# EAGLE design IO60P16 (EAGLE 6.2)
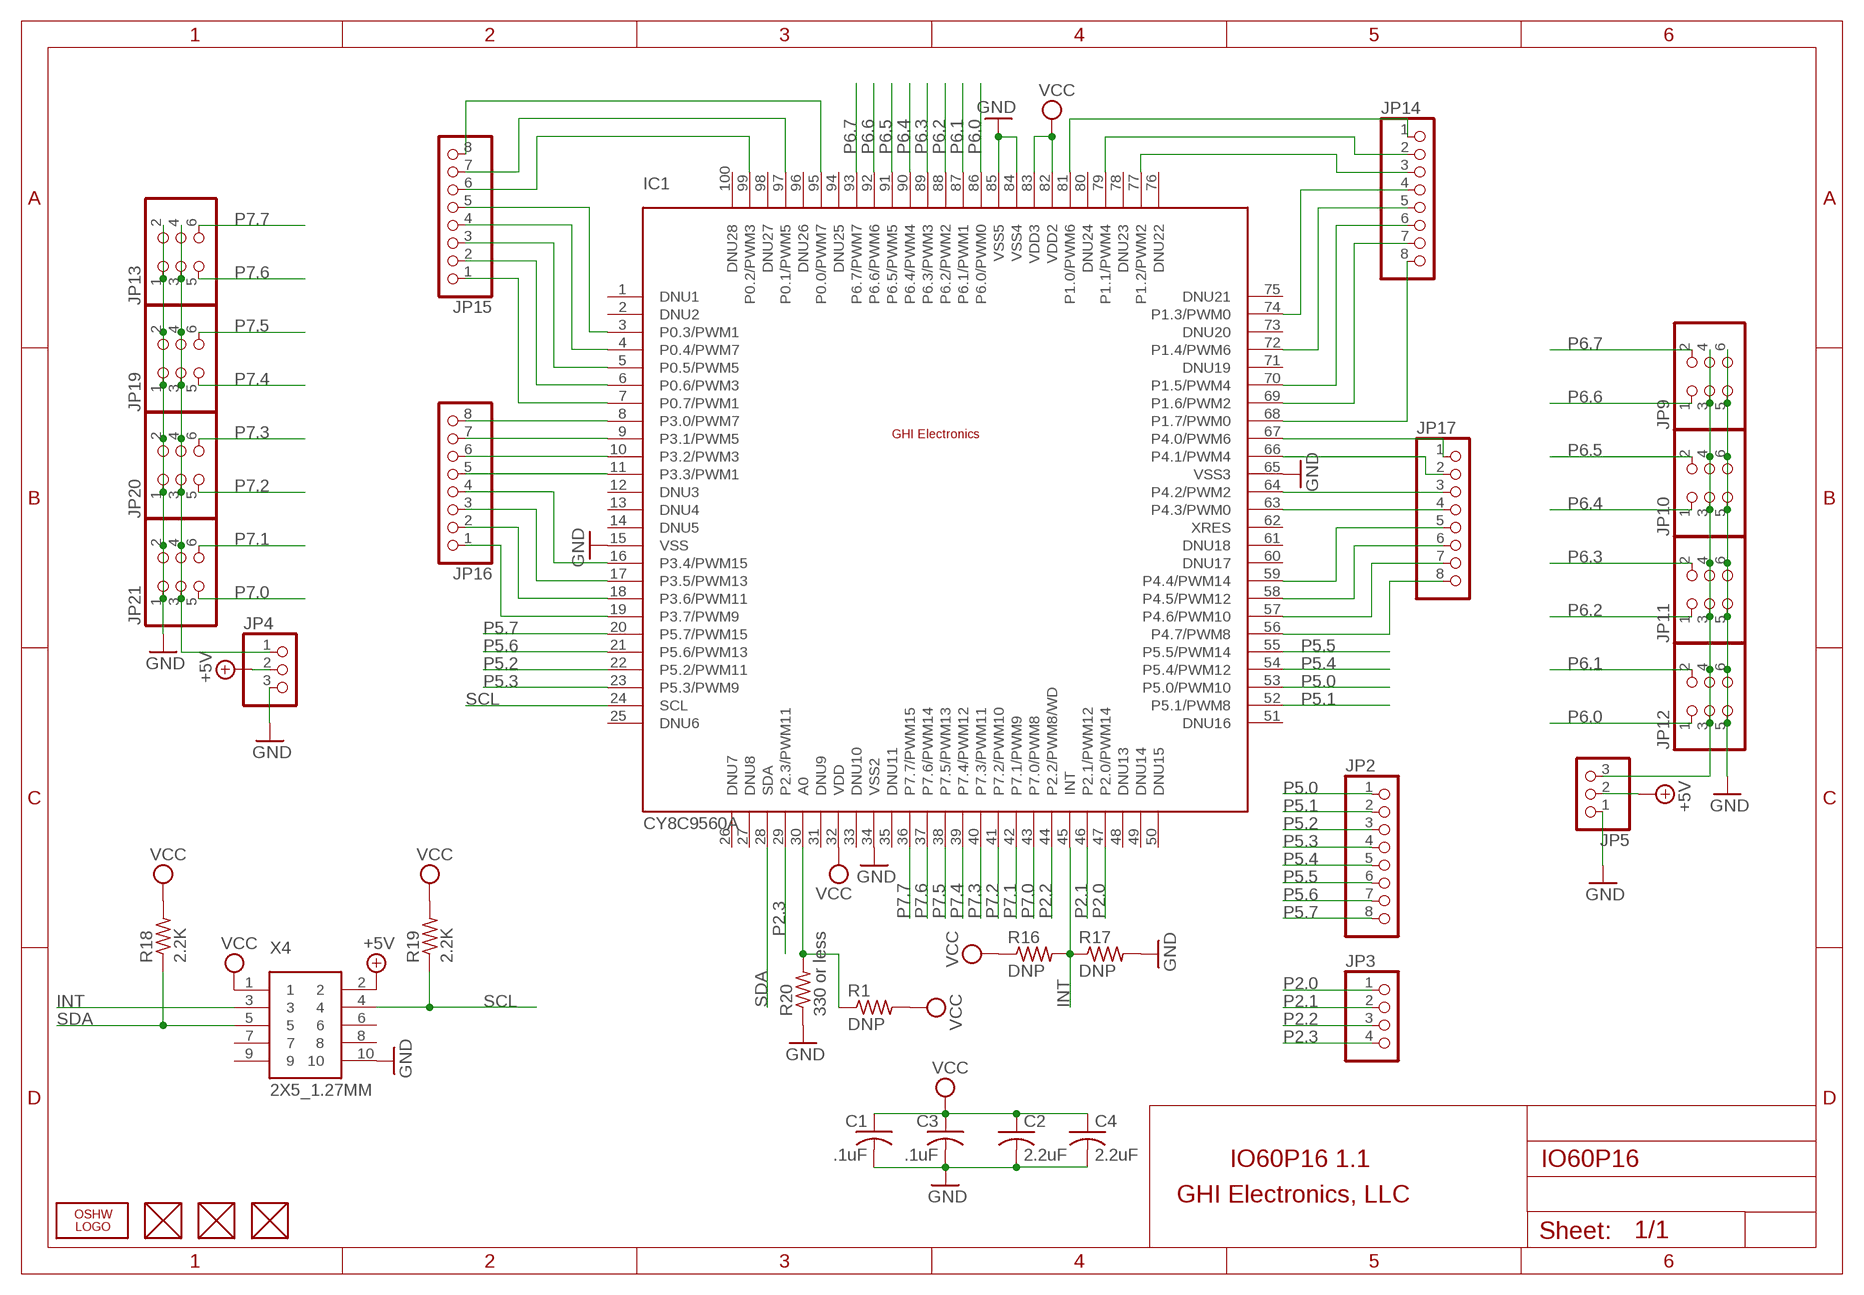
[diagram p0: schematic, sheet 1]

## Parts
C1  .1uF  C-USC0603K  [C0603K]
C2  2.2uF  C-USC0805K  [C0805K]
C3  .1uF  C-USC0603K  [C0603K]
C4  2.2uF  C-USC0805K  [C0805K]
FUD1  FIDUCIAL  [FIDUCIAL_40MIL]
FUD2  FIDUCIAL  [FIDUCIAL_40MIL]
FUD3  FIDUCIAL  [FIDUCIAL_40MIL]
IC1  CY8C9560A  [LQFP100]
JP2  PINHD-1X8  [1X08]
JP3  PINHD-1X4  [1X04]
JP4  PINHD-1X3  [1X03]
JP5  PINHD-1X3  [1X03]
JP9  PINHD-2X3  [2X03]
JP10  PINHD-2X3  [2X03]
JP11  PINHD-2X3  [2X03]
JP12  PINHD-2X3  [2X03]
JP13  PINHD-2X3  [2X03]
JP14  PINHD-1X8  [1X08]
JP15  PINHD-1X8  [1X08]
JP16  PINHD-1X8  [1X08]
JP17  PINHD-1X8  [1X08]
JP19  PINHD-2X3  [2X03]
JP20  PINHD-2X3  [2X03]
JP21  PINHD-2X3  [2X03]
LOGO1  LOGO-OSHW-FILLX0200-NT  [OSHW_FILLX200_NOTEXT]
R1  DNP  R-US_R0603  [R0603]
R16  DNP  R-US_R0603  [R0603]
R17  DNP  R-US_R0603  [R0603]
R18  2.2K  R-US_R0603  [R0603]
R19  2.2K  R-US_R0603  [R0603]
R20  330 or less  R-US_R0603  [R0603]
X4  2X5_1.27MM  [2X5_1.27MM]

## Nets
+5V [power]: JP4.2 JP5.2 X4.2
GND [power]: C1.2 C2.2 C3.2 C4.2 IC1.15(VSS) IC1.34(VSS2) IC1.65(VSS3) IC1.84(VSS4) IC1.85(VSS5) JP4.3 JP5.1 JP9.5 JP9.6 JP10.5 JP10.6 JP11.5 JP11.6 JP12.5 JP12.6 JP13.1 JP13.2 JP19.1 JP19.2 JP20.1 JP20.2 JP21.1 JP21.2 R17.2 R20.1 X4.10
INT: IC1.45(INT) R16.2 R17.1 X4.3
N$1: JP5.3 JP9.3 JP9.4 JP10.3 JP10.4 JP11.3 JP11.4 JP12.3 JP12.4
N$2: JP4.1 JP13.3 JP13.4 JP19.3 JP19.4 JP20.3 JP20.4 JP21.3 JP21.4
N$3: IC1.81(P1.0/PWM6) JP14.1
N$4: IC1.79(P1.1/PWM4) JP14.2
N$5: IC1.77(P1.2/PWM2) JP14.3
N$6: IC1.74(P1.3/PWM0) JP14.4
N$7: IC1.72(P1.4/PWM6) JP14.5
N$8: IC1.70(P1.5/PWM4) JP14.6
N$9: IC1.69(P1.6/PWM2) JP14.7
N$10: IC1.68(P1.7/PWM0) JP14.8
N$11: IC1.67(P4.0/PWM6) JP17.1
N$12: IC1.66(P4.1/PWM4) JP17.2
N$13: IC1.64(P4.2/PWM2) JP17.3
N$14: IC1.63(P4.3/PWM0) JP17.4
N$15: IC1.59(P4.4/PWM14) JP17.5
N$17: IC1.58(P4.5/PWM12) JP17.6
N$18: IC1.57(P4.6/PWM10) JP17.7
N$19: IC1.56(P4.7/PWM8) JP17.8
N$20: IC1.8(P3.0/PWM7) JP16.8
N$21: IC1.9(P3.1/PWM5) JP16.7
N$22: IC1.10(P3.2/PWM3) JP16.6
N$23: IC1.11(P3.3/PWM1) JP16.5
N$24: IC1.30(A0) R1.1 R20.2
N$25: IC1.16(P3.4/PWM15) JP16.4
N$26: IC1.17(P3.5/PWM13) JP16.3
N$27: IC1.18(P3.6/PWM11) JP16.2
N$28: IC1.19(P3.7/PWM9) JP16.1
N$29: IC1.95(P0.0/PWM7) JP15.8
N$30: IC1.97(P0.1/PWM5) JP15.7
N$31: IC1.99(P0.2/PWM3) JP15.6
N$32: IC1.3(P0.3/PWM1) JP15.5
N$33: IC1.4(P0.4/PWM7) JP15.4
N$34: IC1.5(P0.5/PWM5) JP15.3
N$35: IC1.6(P0.6/PWM3) JP15.2
N$36: IC1.7(P0.7/PWM1) JP15.1
P2.0: IC1.47(P2.0/PWM14) JP3.1
P2.1: IC1.46(P2.1/PWM12) JP3.2
P2.2: IC1.44(P2.2/PWM8/WD) JP3.3
P2.3: IC1.29(P2.3/PWM11) JP3.4
P5.0: IC1.53(P5.0/PWM10) JP2.1
P5.1: IC1.52(P5.1/PWM8) JP2.2
P5.2: IC1.22(P5.2/PWM11) JP2.3
P5.3: IC1.23(P5.3/PWM9) JP2.4
P5.4: IC1.54(P5.4/PWM12) JP2.5
P5.5: IC1.55(P5.5/PWM14) JP2.6
P5.6: IC1.21(P5.6/PWM13) JP2.7
P5.7: IC1.20(P5.7/PWM15) JP2.8
P6.0: IC1.86(P6.0/PWM0) JP12.1
P6.1: IC1.87(P6.1/PWM1) JP12.2
P6.2: IC1.88(P6.2/PWM2) JP11.1
P6.3: IC1.89(P6.3/PWM3) JP11.2
P6.4: IC1.90(P6.4/PWM4) JP10.1
P6.5: IC1.91(P6.5/PWM5) JP10.2
P6.6: IC1.92(P6.6/PWM6) JP9.1
P6.7: IC1.93(P6.7/PWM7) JP9.2
P7.0: IC1.43(P7.0/PWM8) JP21.5
P7.1: IC1.42(P7.1/PWM9) JP21.6
P7.2: IC1.41(P7.2/PWM10) JP20.5
P7.3: IC1.40(P7.3/PWM11) JP20.6
P7.4: IC1.39(P7.4/PWM12) JP19.5
P7.5: IC1.38(P7.5/PWM13) JP19.6
P7.6: IC1.37(P7.6/PWM14) JP13.5
P7.7: IC1.36(P7.7/PWM15) JP13.6
SCL: IC1.24(SCL) R19.1 X4.4
SDA: IC1.28(SDA) R18.1 X4.5
VCC [power]: C1.1 C2.1 C3.1 C4.1 IC1.32(VDD) IC1.82(VDD2) IC1.83(VDD3) R1.2 R16.1 R18.2 R19.2 X4.1
Unconnected: FUD1.P$1 FUD2.P$1 FUD3.P$1 IC1.1(DNU1) IC1.2(DNU2) IC1.12(DNU3) IC1.13(DNU4) IC1.14(DNU5) IC1.25(DNU6) IC1.26(DNU7) IC1.27(DNU8) IC1.31(DNU9) IC1.33(DNU10) IC1.35(DNU11) IC1.48(DNU13) IC1.49(DNU14) IC1.50(DNU15) IC1.51(DNU16) IC1.60(DNU17) IC1.61(DNU18) IC1.62(XRES) IC1.71(DNU19) IC1.73(DNU20) IC1.75(DNU21) IC1.76(DNU22) IC1.78(DNU23) IC1.80(DNU24) IC1.94(DNU25) IC1.96(DNU26) IC1.98(DNU27) IC1.100(DNU28) X4.6 X4.7 X4.8 X4.9

## Notes on the sheet
- IO60P16 1.1
- GHI Electronics, LLC

## Library data of the parts
C1-C4 = rcl:C-US: CAPACITOR, American symbol
FUD1-FUD3 = GHI:FIDUCIAL
IC1 = GHI:CY8C9560A
JP2 JP14-JP17 = pinhead:PINHD-1X8: PIN HEADER
JP3 = pinhead:PINHD-1X4: PIN HEADER
JP4 JP5 = pinhead:PINHD-1X3: PIN HEADER
JP9-JP13 JP19-JP21 = pinhead:PINHD-2X3: PIN HEADER
LOGO1 = Logo:LOGO-OSHW-FILL
R1 R16-R20 = rcl:R-US_: RESISTOR, American symbol
X4 = GHI:2X5_1.27MM

## Board
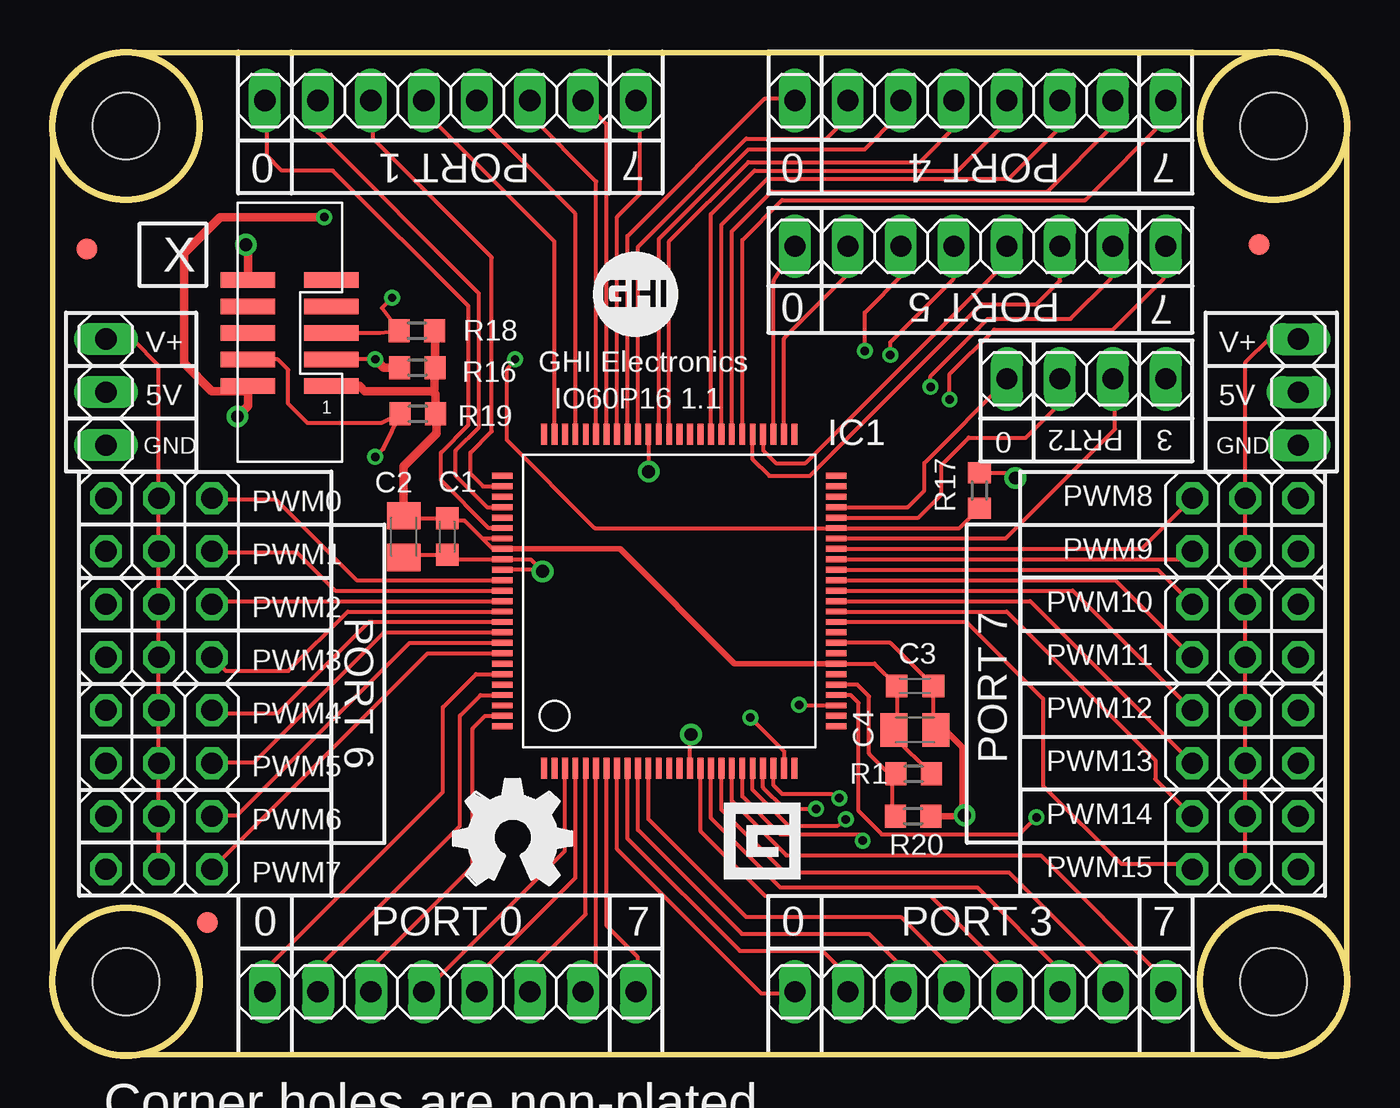
[diagram p1: board, top side]
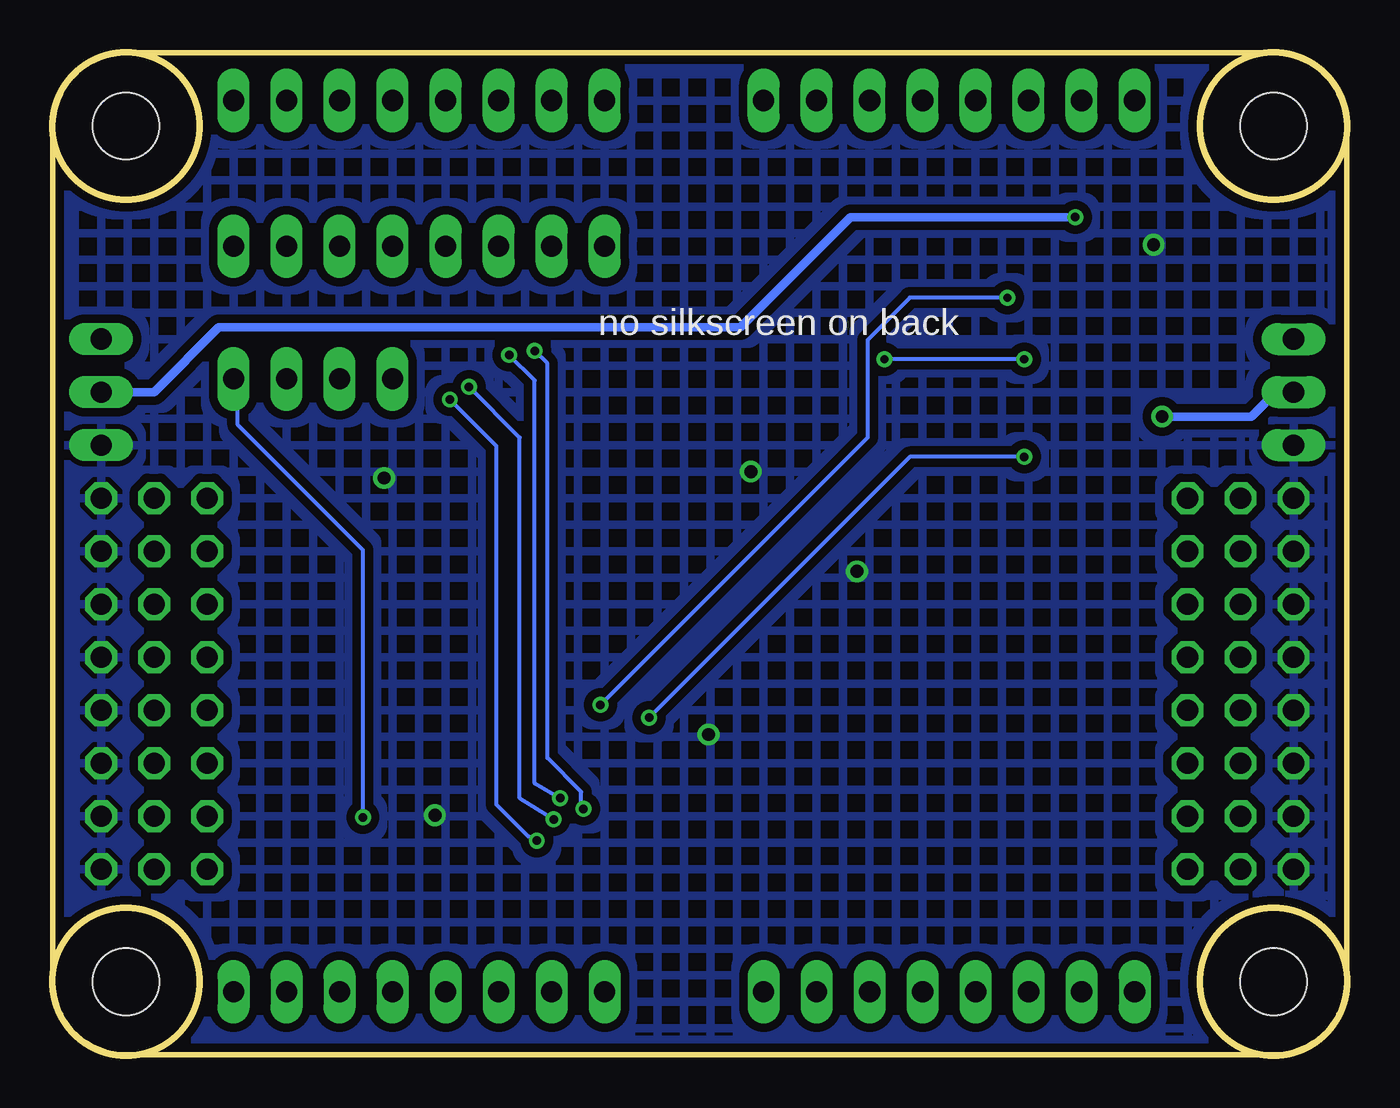
[diagram p2: board, bottom side, seen from below]

Size 62.07 x 48.07 mm. Coordinates in mm from the lower left corner, seen from the top.
Outline: 58.54,0.04 arc90 62.04,3.54 62.04,44.54 arc90 58.54,48.04 3.54,48.04 arc90 0.04,44.54 0.04,3.54 arc90 3.54,0.04 58.54,0.04
Outline: circle at 58.54,3.54 radius 3.54
Outline: circle at 3.54,3.54 radius 3.54
Outline: circle at 3.54,44.54 radius 3.54
Outline: circle at 58.54,44.54 radius 3.54
Copper layers (1+16): Top 0.035mm / dielectric 1.5mm / Bottom 0.035mm
Design rules "default *": minimum track width 8mil, minimum drill 12mil, track to track 8mil, track to pad 8mil, pad to pad 8mil, via to via 8mil, smd to smd 8mil, copper to edge 15mil, drill to drill 8mil, minimum pad ring 10mil, minimum via ring 7mil, stop-mask expansion 4mil, vias tented up to drill 50mil, thermal gap 10mil
Holes 3.2 mm at 3.54,3.54 58.54,3.54 3.54,44.54 58.54,44.54

### Footprints (pad centres in the part's own frame; a part is rotated, then mirrored left to right if it is on the bottom)
C0603K = smd 1.05 x 1.08: 1 -0.875,0; 2 0.875,0
C0805K = smd 1.3 x 1.6: 1 -1,0; 2 1,0
FIDUCIAL_40MIL = smd 1.016 x 1.016: P$1 0,0
LQFP100 = smd 0.28 x 1: 1 -6,-8; 2 -5.5,-8; 3 -5,-8; 4 -4.5,-8; 5 -4,-8; 6 -3.5,-8; 7 -3,-8; 8 -2.5,-8; 9 -2,-8; 10 -1.5,-8; 11 -1,-8; 12 -0.5,-8; 13 0,-8; 14 0.5,-8; 15 1,-8; 16 1.5,-8; 17 2,-8; 18 2.5,-8; 19 3,-8; 20 3.5,-8; 21 4,-8; 22 4.5,-8; 23 5,-8; 24 5.5,-8; 25 6,-8; 51 6,8; 52 5.5,8; 53 5,8; 54 4.5,8; 55 4,8; 56 3.5,8; 57 3,8; 58 2.5,8; 59 2,8; 60 1.5,8; 61 1,8; 62 0.5,8; 63 0,8; 64 -0.5,8; 65 -1,8; 66 -1.5,8; 67 -2,8; 68 -2.5,8; 69 -3,8; 70 -3.5,8; 71 -4,8; 72 -4.5,8; 73 -5,8; 74 -5.5,8; 75 -6,8 | smd 1 x 0.28: 26 8,-6; 27 8,-5.5; 28 8,-5; 29 8,-4.5; 30 8,-4; 31 8,-3.5; 32 8,-3; 33 8,-2.5; 34 8,-2; 35 8,-1.5; 36 8,-1; 37 8,-0.5; 38 8,0; 39 8,0.5; 40 8,1; 41 8,1.5; 42 8,2; 43 8,2.5; 44 8,3; 45 8,3.5; 46 8,4; 47 8,4.5; 48 8,5; 49 8,5.5; 50 8,6; 76 -8,6; 77 -8,5.5; 78 -8,5; 79 -8,4.5; 80 -8,4; 81 -8,3.5; 82 -8,3; 83 -8,2.5; 84 -8,2; 85 -8,1.5; 86 -8,1; 87 -8,0.5; 88 -8,0; 89 -8,-0.5; 90 -8,-1; 91 -8,-1.5; 92 -8,-2; 93 -8,-2.5; 94 -8,-3; 95 -8,-3.5; 96 -8,-4; 97 -8,-4.5; 98 -8,-5; 99 -8,-5.5; 100 -8,-6
1X08 = drill 1.016 long: 1 -8.89,0; 2 -6.35,0; 3 -3.81,0; 4 -1.27,0; 5 1.27,0; 6 3.81,0; 7 6.35,0; 8 8.89,0
1X04 = drill 1.016 long: 1 -3.81,0; 2 -1.27,0; 3 1.27,0; 4 3.81,0
1X03 = drill 1.016 long: 1 -2.54,0; 2 0,0; 3 2.54,0
2X03 = drill 1.016 octagon: 1 -2.54,-1.27; 2 -2.54,1.27; 3 0,-1.27; 4 0,1.27; 5 2.54,-1.27; 6 2.54,1.27
R0603 = smd 1 x 1.1: 1 -0.85,0; 2 0.85,0
2X5_1.27MM = smd 2.6 x 0.74: 1 -2,2.58; 2 2,2.58; 3 -2,1.31; 4 2,1.31; 5 -2,0.04; 6 2,0.04; 7 -2,-1.23; 8 2,-1.23; 9 -2,-2.5; 10 2,-2.5

### Placement (x,y rotation side)
C1  18.93,24.86 270 top
C2  16.85,24.86 270 top
C3  41.35,17.71 0 top
C4  41.35,15.61 0 top
FUD1  57.85,38.85 0 top
FUD2  7.45,6.39 0 top
FUD3  1.66,38.64 0 top
IC1  29.57,21.77 0 top
JP2  44.49,38.77 0 top
JP3  49.57,32.42 0 top
JP4  59.73,31.79 270 top
JP5  2.58,31.79 90 top
JP9  5.12,10.2 180 top
JP10  5.12,15.28 180 top
JP11  5.12,20.36 180 top
JP12  5.12,25.44 180 top
JP13  57.19,10.2 180 top
JP14  19.09,45.76 0 top
JP15  19.09,3.06 180 top
JP16  44.49,3.06 180 top
JP17  44.49,45.76 0 top
JP19  57.19,15.28 180 top
JP20  57.19,20.36 180 top
JP21  57.19,25.44 180 top
LOGO1  19.23,8.16 0 top
R1  41.29,13.5 0 top
R16  17.5,32.95 180 top
R17  44.43,27.08 90 top
R18  17.47,34.73 0 top
R19  17.52,30.74 0 top
R20  41.27,11.47 180 top
X4  11.39,34.66 180 top

### Tracks (layer width: path | path; a pad name or v marks a point on that pad's centre or on a via)
+5V  (via drill 0.41, 0.61)
  Top 0.406: v8.87,30.62 9.39,31.13 X4.2 9.14,31.84 7.66,31.84 6.33,33.16 6.33,38.44 8.06,40.17 v13.04,40.17 | 3.49,31.63 2.73,31.63 JP5.2
  Bottom 0.406: v8.87,30.62 4.61,30.62 3.39,31.84 2.63,31.84 JP5.2 | JP4.2 57.19,31.79 54.09,34.88 29.09,34.88 23.81,40.17 v13.04,40.17
GND  (via drill 0.61)
  Top 0.203: IC1.34 40.16,19.77 C3.2 42.22,15.73 C4.2 | IC1.15 30.57,15.33 v30.62,15.38 | IC1.85 23.43,23.27 v23.51,23.2 22.93,23.77 IC1.84 19.35,23.77 C1.2 17.18,23.99 C2.2 | IC1.65 28.57,27.99 v28.59,27.98 | R17.2 45.91,27.93 v46.16,27.67
  Top 0.305: C4.2 42.78,15.61 43.62,14.77 43.62,11.62 v43.72,11.52 43.67,11.47 R20.1
  Top 0.406: X4.10 9.39,38.74 v9.28,38.85
  pour Bottom (isolate 0.406, hatched): 0.14,48.38 0.14,-0.37 61.84,-0.37 61.84,48.38
INT  (via drill 0.41)
  Top 0.203: 44.41,26.2 R17.1 43.48,25.27 IC1.45 26,25.27 21.78,29.5 21.78,32.85 v22.18,33.36 | v15.48,33.36 13.4,33.36 X4.3
  Top 0.406: R16.2 15.89,32.95 v15.48,33.36
  Bottom 0.203: v15.48,33.36 v22.18,33.36
N$1
  Top 0.203: JP9.4 JP9.3 JP10.4 JP10.3 JP11.4 JP11.3 JP12.4 JP12.3 5.12,33.06 3.9,34.27 2.63,34.27 JP5.3
N$2
  Top 0.203: JP13.4 JP13.3 JP19.4 JP19.3 JP20.4 JP20.3 JP21.4 JP21.3 57.19,33.21 58.35,34.38 59.67,34.38 JP4.1
N$3
  Top 0.203: IC1.81 20.92,25.27 18.63,27.57 18.63,28.89 19.95,30.21 19.95,35.9 13.45,42.4 11.01,42.4 10.3,43.11 10.3,45.65 JP14.1
N$4
  Top 0.203: IC1.79 20.84,26.27 19.34,27.77 19.34,28.99 20.46,30.11 20.46,36.51 12.74,44.23 JP14.2
N$5
  Top 0.203: IC1.77 20.65,27.27 20.05,27.87 20.05,28.89 21.07,29.91 21.07,38.24 15.38,43.93 15.38,45.65 JP14.3
N$6
  Top 0.203: IC1.74 24.07,38.99 17.92,45.15 17.92,45.65 JP14.4
N$7
  Top 0.203: IC1.72 25.07,40.33 20.15,45.25 20.15,45.55 JP14.5
N$8
  Top 0.203: IC1.70 26.07,41.87 22.9,45.04 JP14.6
N$9
  Top 0.203: IC1.69 26.57,44.62 JP14.7
N$10
  Top 0.203: IC1.68 27.07,40.18 28.18,41.29 28.18,45.04 28.28,45.15 28.28,45.45 JP14.8
N$11
  Top 0.203: IC1.67 27.57,39.26 34.17,45.86 35.49,45.86 JP17.1
N$12
  Top 0.203: IC1.66 28.07,38.74 33.26,43.93 37.12,43.93 38.14,44.94 JP17.2
N$13
  Top 0.203: IC1.64 29.07,39.13 33.36,43.42 38.95,43.42 40.47,44.94 40.47,45.55 JP17.3
N$14
  Top 0.203: IC1.63 29.57,39.02 33.36,42.81 41.59,42.81 43.42,44.64 43.42,45.55 JP17.4
N$15
  Top 0.203: IC1.59 31.57,40.31 33.67,42.4 43.42,42.4 45.76,44.74 JP17.5
N$17
  Top 0.203: IC1.58 32.07,39.79 34.27,42 45.86,42 48.4,44.54 48.4,45.65 JP17.6
N$18
  Top 0.203: IC1.57 32.57,39.48 34.48,41.39 47.69,41.39 50.84,44.54 JP17.7
N$19
  Top 0.203: IC1.56 33.07,39.07 34.99,40.98 49.51,40.98 53.48,44.94 53.48,45.65 JP17.8
N$20
  Top 0.203: IC1.8 27.07,9.88 33.97,2.98 35.52,2.98 JP16.8
N$21
  Top 0.203: IC1.9 27.57,10.4 32.95,5.01 36.92,5.01 38.14,3.79 JP16.7
N$22
  Top 0.203: IC1.10 28.07,10.81 33.06,5.83 39.15,5.83 40.78,4.2 40.78,3.16 JP16.6
N$23
  Top 0.203: IC1.11 28.57,11.33 33.26,6.64 40.68,6.64 43.32,4 43.32,3.16 JP16.5
N$24
  Top 0.203: IC1.30 38.58,17.77 39.15,17.21 39.15,14.46 39.96,13.65 40.27,13.65 40.47,13.65 | 40.27,13.5 40.27,11.62 R20.2
  Top 0.406: R1.1 40.27,13.5 40.27,13.65
N$25
  Top 0.203: IC1.16 31.07,10.76 34.17,7.66 42.1,7.66 45.65,4.1 45.65,3.16 JP16.4
N$26
  Top 0.203: IC1.17 31.57,11.37 34.88,8.06 44.33,8.06 48.3,4.1 JP16.3
N$27
  Top 0.203: IC1.18 32.07,11.79 35.09,8.77 45.86,8.77 50.73,3.9 50.73,3.16 JP16.2
N$28
  Top 0.203: IC1.19 32.57,12.2 35.19,9.59 47.38,9.59 53.38,3.59 JP16.1
N$29
  Top 0.203: IC1.95 20.31,18.27 18.73,16.7 18.73,12.63 10.2,4.1 JP15.8
N$30
  Top 0.203: IC1.97 20.53,17.27 19.54,16.29 19.54,11.01 12.84,4.3 12.84,3.16 JP15.7
N$31
  Top 0.203: IC1.99 20.74,16.27 20.15,15.68 20.15,9.08 15.58,4.51 15.58,3.36 JP15.6
N$32
  Top 0.203: IC1.3 24.57,9.81 JP15.5
N$33
  Top 0.203: IC1.4 25.07,8.51 20.36,3.79 JP15.4
N$34
  Top 0.203: IC1.5 25.57,6.78 22.79,4 22.79,3.16 JP15.3
N$35
  Top 0.203: IC1.6 26.07,3.69 JP15.2
N$36
  Top 0.203: IC1.7 26.57,6.21 28.08,4.71 28.08,3.16 JP15.1
P2.0
  Top 0.203: IC1.47 41.01,26.27 41.79,27.06 41.79,28.38 45.86,32.45 45.68,32.34 JP3.1
P2.1
  Top 0.203: IC1.46 41.52,25.77 42.61,26.86 42.61,28.28 43.93,29.6 46.67,29.6 48.19,31.13 48.19,32.32 JP3.2
P2.2
  Top 0.203: IC1.44 45.7,24.77 50.94,30.01 50.94,32.32 JP3.3
P2.3  (via drill 0.41)
  Top 0.203: IC1.29 38.27,17.27 38.64,16.9 38.64,13.95 38.64,11.72 39.76,10.6 46.37,10.6 v47.18,11.41
  Bottom 0.203: v47.18,11.41 47.18,24.22 53.17,30.21 53.17,32.22 JP3.4
P5.0
  Top 0.203: IC1.53 34.57,37.11 JP2.1
P5.1
  Top 0.203: IC1.52 35.07,34.36 38.14,37.42 JP2.2
P5.2  (via drill 0.41)
  Top 0.203: IC1.22 34.07,12.84 35.09,11.82 v36.61,11.82 | v38.95,33.77 38.95,35.6 40.78,37.42 40.78,38.67 JP2.3
  Bottom 0.203: v36.61,11.82 36.71,11.82 36.71,12.63 38.34,14.26 38.34,33.16 v38.95,33.77
P5.3  (via drill 0.41)
  Top 0.203: IC1.23 34.57,12.95 34.99,12.53 37.32,12.53 v37.73,12.33 | v40.17,33.56 40.17,34.17 43.22,37.22 JP2.4
  Bottom 0.203: v37.73,12.33 38.95,13.04 38.95,32.34 v40.17,33.56
P5.4
  Top 0.203: IC1.54 34.07,28.99 34.68,28.38 36.1,28.38 45.25,37.53 45.25,37.63 JP2.5
P5.5
  Top 0.203: IC1.55 33.57,28.58 34.38,27.77 36.31,27.77 44.54,36 47.18,36 48.3,37.12 JP2.6
P5.6  (via drill 0.41)
  Top 0.203: IC1.21 33.57,12.73 35.29,11.01 37.63,11.01 v38.03,11.31 | v42.1,32.04 42.1,32.55 44.84,35.29 48.8,35.29 50.73,37.22 50.73,38.67 JP2.7
  Bottom 0.203: v38.03,11.31 39.66,12.33 39.66,29.6 v42.1,32.04
P5.7  (via drill 0.41)
  Top 0.203: IC1.20 33.07,12.41 34.88,10.6 38.75,10.6 v38.85,10.3 | v43.01,31.43 43.01,32.65 45.15,34.78 50.84,34.78 53.27,37.22 53.27,38.67 JP2.8
  Bottom 0.203: v38.85,10.3 39.25,10.5 40.78,12.02 40.78,29.19 v43.01,31.43
P6.0
  Top 0.203: IC1.86 14.58,22.77 10.7,26.65 7.71,26.65 JP12.1
P6.1
  Top 0.203: IC1.87 13.56,22.27 11.72,24.11 7.71,24.11 JP12.2
P6.2
  Top 0.203: IC1.88 7.8,21.77 JP11.1
P6.3
  Top 0.203: IC1.89 14.16,21.27 11.31,18.43 8.32,18.43 JP11.2
P6.4
  Top 0.203: IC1.90 15.19,20.77 10.81,16.39 7.81,16.39 JP10.1
P6.5
  Top 0.203: IC1.91 15.91,20.27 9.69,14.06 7.71,14.06 JP10.2
P6.6
  Top 0.203: IC1.92 17.13,19.77 8.87,11.52 7.71,11.52 JP9.1
P6.7
  Top 0.203: IC1.93 18,19.27 JP9.2
P7.0
  Top 0.203: IC1.43 52.21,24.27 JP21.5
P7.1
  Top 0.203: IC1.42 54.25,23.77 JP21.6
P7.2
  Top 0.203: IC1.41 53,23.27 JP20.5
P7.3
  Top 0.203: IC1.40 50.96,22.77 JP20.6
P7.4
  Top 0.203: IC1.39 48.92,22.27 JP19.5
P7.5
  Top 0.203: IC1.38 46.88,21.77 JP19.6
P7.6
  Top 0.203: IC1.37 45.75,21.27 52.87,14.16 52.87,13.24 JP13.5
P7.7
  Top 0.203: IC1.36 43.81,20.77 47.48,17.1 47.48,12.94 51.24,9.18 54.39,9.18 JP13.6
SCL  (via drill 0.41)
  Top 0.203: X4.4 10.82,33.35 11.31,32.85 11.31,31.23 12.23,30.31 15.79,30.31 R19.1 15.86,29.07 v15.48,28.69 | IC1.24 35.07,14.58 v33.46,16.19
  Bottom 0.203: v15.48,28.69 20.97,28.69 v33.46,16.19
SDA  (via drill 0.41)
  Top 0.203: v16.29,36.31 15.81,35.83 R18.1 15.7,34.62 X4.5 | IC1.28 35.82,16.77 v35.8,16.8
  Bottom 0.203: v16.29,36.31 20.97,36.31 23,34.27 23,29.6 v35.8,16.8
VCC
  Top 0.203: IC1.32 39.41,18.77 C3.1 40.47,15.73 C4.1 40.35,15.28 R1.2 | 20.61,24.77 IC1.82 | 20.61,24.77 19.75,25.64 19.24,25.64 C1.1 17.18,25.74 C2.1 | IC1.83 21.11,24.27 20.61,24.77
  Top 0.254: IC1.83 27.21,24.27 32.71,18.77 IC1.32
  Top 0.406: C2.1 16.85,28.23 18.43,29.8 18.43,30.69 R19.2 18.37,31.68 18.22,31.84 | X4.1 14.73,32.08 14.97,31.84 18.22,31.84 | 18.22,31.84 18.32,31.94 18.32,32.93 R16.1 18.35,34.71 R18.2

### Text on the board
tPlace: 0 | PORT 1 | 7 | 0 | PORT 4 | 7 | X | 0 | PORT 5 | 7 | V+ | V+ | GHI Electronics | 5V | IO60P16 1.1 | 5V | 0 | PRT2 | 3 | GND | GND | PWM8 | PWM0 | PWM9 | PWM1 | PWM10 | PWM2 | PORT 6 | PWM11 | PWM3 | PWM12 | PWM4 | PWM13 | PORT 7 | PWM5 | PWM14 | PWM6 | PWM15 | PWM7 | 0 | PORT 0 | 7 | 0 | PORT 3 | 7 | Corner holes are non-plated | black PCB with white text | do not add manufacturing codes
bPlace: no silkscreen on back